# EAGLE design Fireplace Control (EAGLE 6.4)
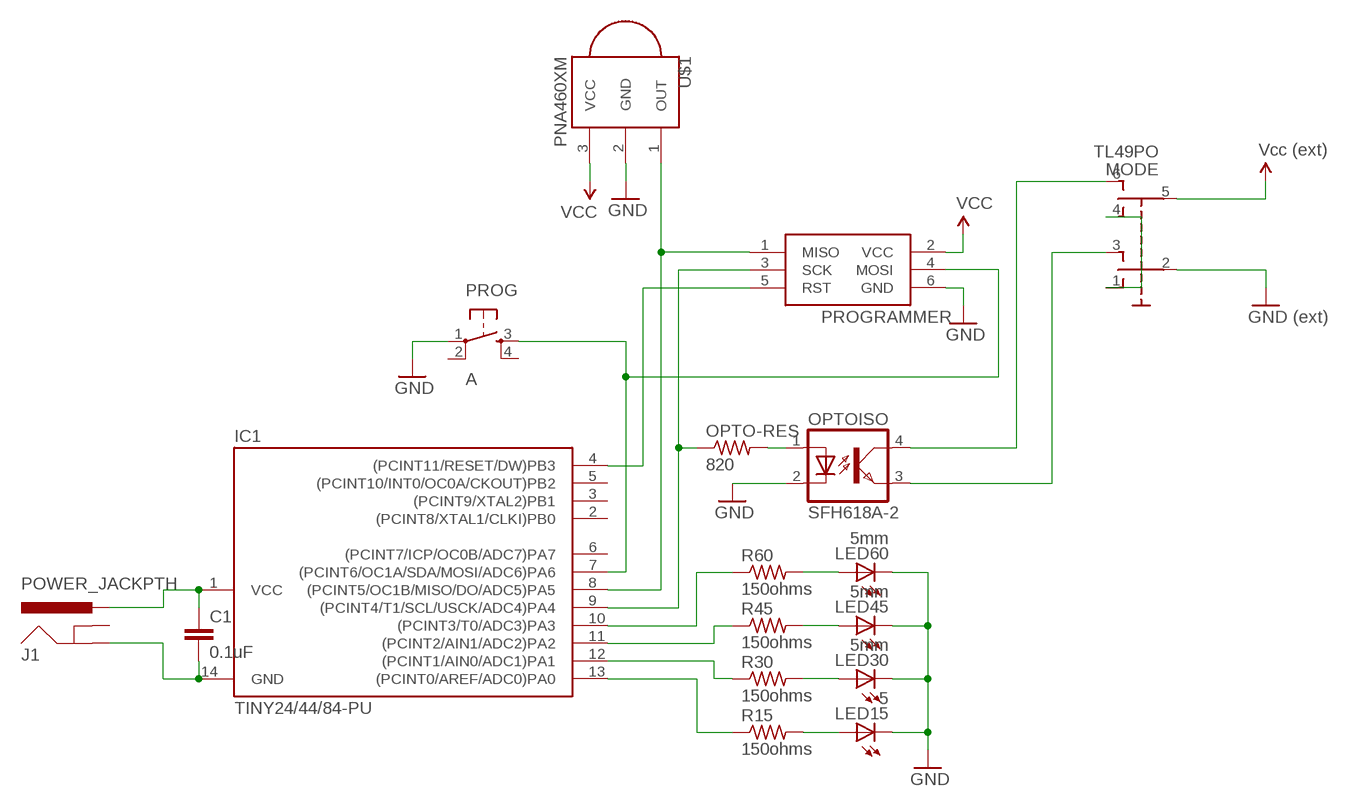
[diagram p0: schematic, sheet 1]

## Parts
C1  0.1uF  CAPKIT  [CAP-PTH-SMALL-KIT]
IC1  TINY24/44/84-PU  [DIL14]
J1  POWER_JACKPTH  [POWER_JACK_PTH]
LED15  5  LED3MM  [LED3MM]
LED30  5mm  LED3MM  [LED3MM]
LED45  5mm  LED3MM  [LED3MM]
LED60  5mm  LED3MM  [LED3MM]
MODE  TL49PO  [TL4XPO]
OPTO-RES  820  R-US_0411/15  [0411/15]
OPTOISO  SFH618A-2  [DIP4]
PROG  A  TAC_SWITCHPTH  [TACTILE-PTH]
PROGRAMMER  AVRISP-6  [AVRISP]
R15  150ohms  R-US_0411/15  [0411/15]
R30  150ohms  R-US_0411/15  [0411/15]
R45  150ohms  R-US_0411/15  [0411/15]
R60  150ohms  R-US_0411/15  [0411/15]
U$1  PNA460XM  [PNA460XM]

## Nets
GND: C1.2 IC1.14(GND) J1.GND LED15.K(C) LED30.K(C) LED45.K(C) LED60.K(C) MODE.2(P) OPTOISO.2(C) PROG.1 PROGRAMMER.6(GND) U$1.2(GND) ; supply symbol labelled GND (ext)
N$1: LED15.A R15.2
N$2: LED30.A R30.2
N$3: LED45.A R45.2
N$4: LED60.A R60.2
N$5: IC1.13((PCINT0/AREF/ADC0)PA0) R15.1
N$6: IC1.12((PCINT1/AIN0/ADC1)PA1) R30.1
N$7: IC1.11((PCINT2/AIN1/ADC2)PA2) R45.1
N$8: IC1.10((PCINT3/T0/ADC3)PA3) R60.1
N$9: OPTO-RES.2 OPTOISO.1(A)
N$10: IC1.7((PCINT6/OC1A/SDA/MOSI/ADC6)PA6) PROG.3 PROGRAMMER.4(MOSI)
N$11: IC1.9((PCINT4/T1/SCL/USCK/ADC4)PA4) OPTO-RES.1 PROGRAMMER.3(SCK)
N$12: IC1.8((PCINT5/OC1B/MISO/DO/ADC5)PA5) PROGRAMMER.1(MISO) U$1.1(OUT)
N$14: MODE.1(O) MODE.4(O1)
N$16: MODE.6(S1) OPTOISO.4(COL)
N$17: MODE.3(S) OPTOISO.3(EMIT)
N$18: IC1.4((PCINT11/RESET/DW)PB3) PROGRAMMER.5(RST)
VCC: C1.1 IC1.1(VCC) J1.PWR MODE.5(P1) PROGRAMMER.2(VCC) U$1.3(VCC) ; supply symbol labelled Vcc (ext)
Unconnected: IC1.2((PCINT8/XTAL1/CLKI)PB0) IC1.3((PCINT9/XTAL2)PB1) IC1.5((PCINT10/INT0/OC0A/CKOUT)PB2) IC1.6((PCINT7/ICP/OC0B/ADC7)PA7) J1.GNDBREAK PROG.2 PROG.4

## Library data of the parts
C1 = SparkFun-Capacitors:CAP: Capacitor Standard 0603 ceramic capacitor, and 0.1" leaded capacitor.
IC1 = avr-4:TINY24/44/84
J1 = SparkFun-Connectors:POWER_JACK: Power Jack This is the standard 5.5mm barrel jack for power. The PTH is the most common, proven, reliable, footprint. The Slot footprint only works if the mill layer is transmitted to the PCB fab house so be warned. Spark Fun Electronics SKU : PRT-00119 SMT: CONN-08106 Mating wall wart : TOL-00298 (and others)
LED15 LED30 LED45 LED60 = adafruit:LED: LED OSRAM: - CHIPLED LG R971, LG N971, LY N971, LG Q971, LY Q971, LO R971, LY R971 LH N974, LH R974 LS Q976, LO Q976, LY Q976 LO Q996 - Hyper CHIPLED LW Q18S LB Q993, LB Q99A, LB R99A - SideLED LS A670, LO A670, LY A670, LG A670, LP A670 LB A673, LV A673, LT A673, LW A673 LH A674 LY A675 LS A676, LA A676, LO A676, LY A676, LW A676 LS A679, LY A679, LG A679 - Hyper Micro SIDELED® LS Y876, LA Y876, LO Y876, LY Y876 LT Y87S - SmartLED LW L88C, LW L88S LB L89C, LB L89S, LG L890 LS L89K, LO L89K, LY L89K LS L896, LA L896, LO L896, LY L896 - TOPLED LS T670, LO T670, LY T670, LG T670, LP T670 LSG T670, LSP T670, LSY T670, LOP T670, LYG T670 LG T671, LOG T671, LSG T671 LB T673, LV T673, LT T673, LW T673 LH T674 LS T676, LA T676, LO T676, LY T676, LB T676, LH T676, LSB T676, LW T676 LB T67C, LV T67C, LT T67C, LS T67K, LO T67K, LY T67K, LW E67C LS E67B, LA E67B, LO E67B, LY E67B, LB E67C, LV E67C, LT E67C LW T67C LS T679, LY T679, LG T679 LS T770, LO T770, LY T770, LG T770, LP T770 LB T773, LV T773, LT T773, LW T773 LH T774 LS E675, LA E675, LY E675, LS T675 LS T776, LA T776, LO T776, LY T776, LB T776 LHGB T686 LT T68C, LB T68C - Hyper Mini TOPLED® LB M676 - Mini TOPLED Santana® LG M470 LS M47K, LO M47K, LY M47K Source: http://www.osram.convergy.de/
MODE = switch:TL49PO: TINY SWITCH ON OFF ON Source: http://www2.produktinfo.conrad.com/datenblaetter/700000-724999/705152-da-01-de-Subminiaturschalter_TL_36YO.pdf
OPTO-RES R15 R30 R45 R60 = adafruit:R-US_: RESISTOR, American symbol
OPTOISO = optocoupler:SFH618?*: Optocoupler, Phototransistor Output, Low Input Current Source: Data sheet <http://www.vishay.com/docs/83673/sfh618.pdf>; MF: VISHAY/TELEFUNKEN; MPN: SFH618A-2; OC_FARNELL: 6424855; OC_NEWARK: 21H7744
PROG = SparkFun-Electromechanical:TAC_SWITCH: Momentary Switch Button commonly used for reset or general input. Spark Fun Electronics SKU : COM-00097 SMT- SWCH-08247
PROGRAMMER = adafruit:AVRISP: AVR ISP HEADER Standard 6 pin header for AVR programming
U$1 = adafruit:PNA460XM: IR 38KHz receiver PNA4602 and related receivers http://www.ladyada.net/library/pcb/eaglelibrary.html

## Board
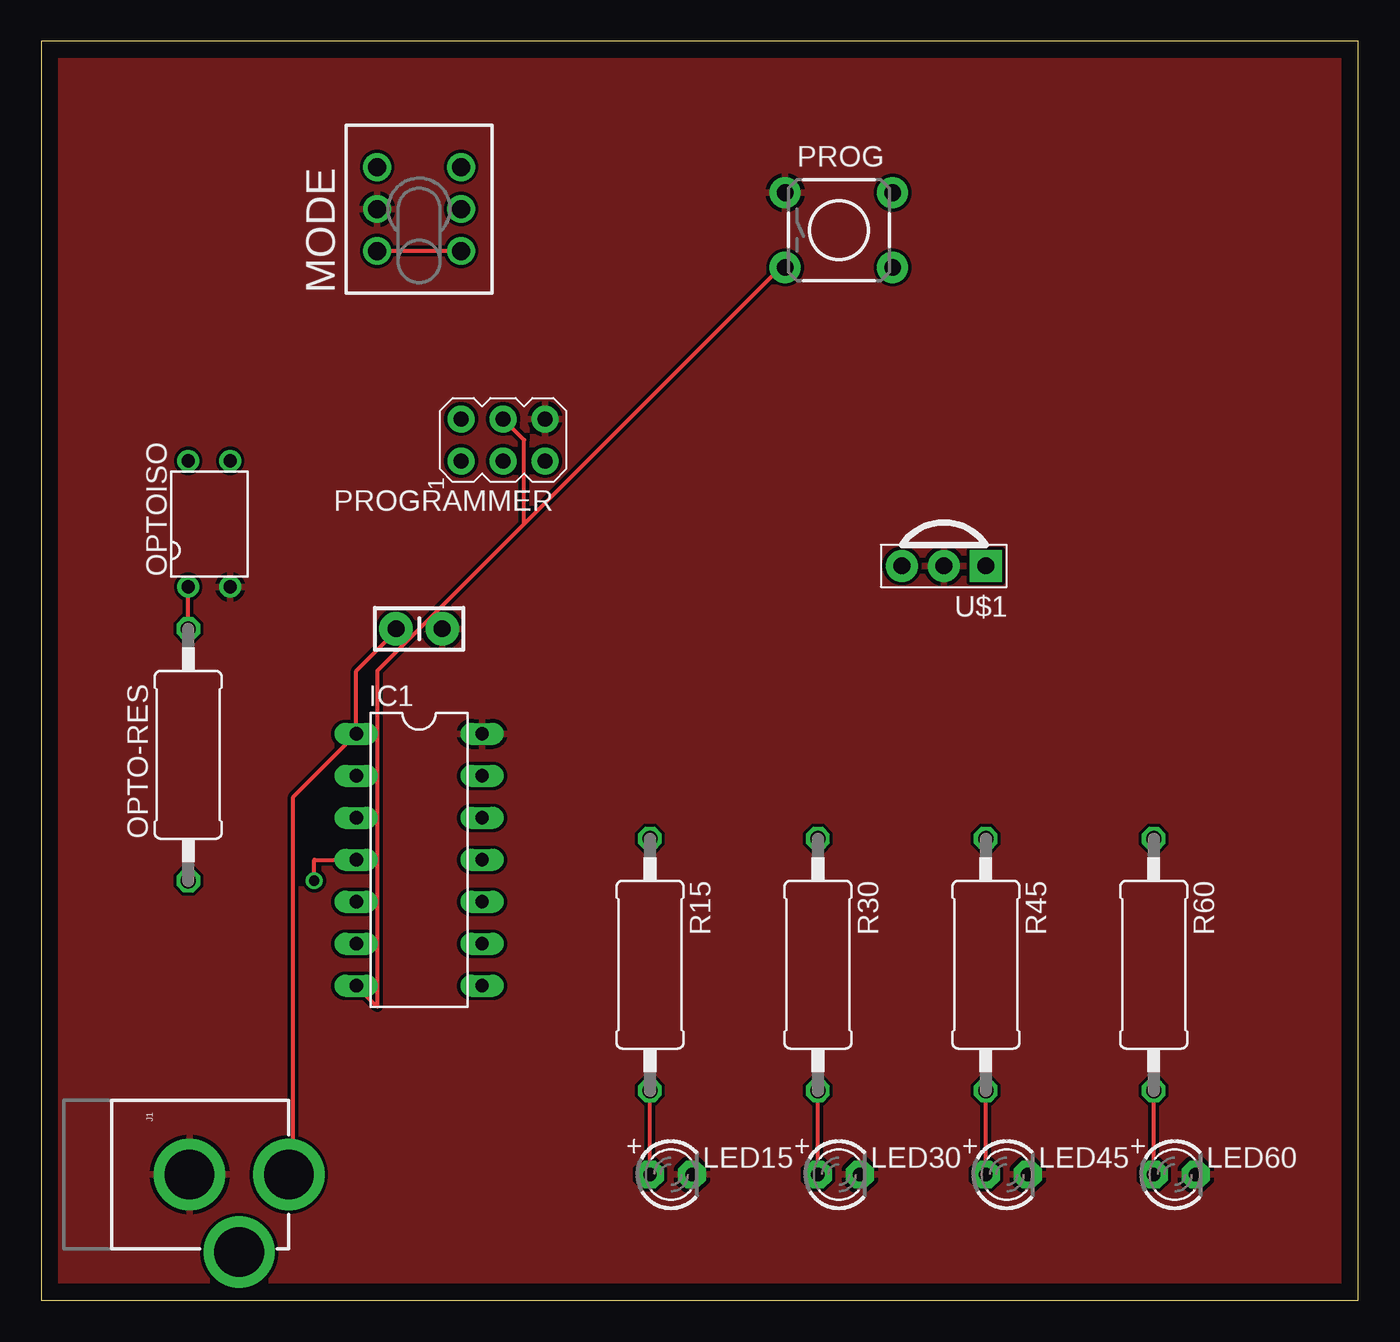
[diagram p1: board, top side]
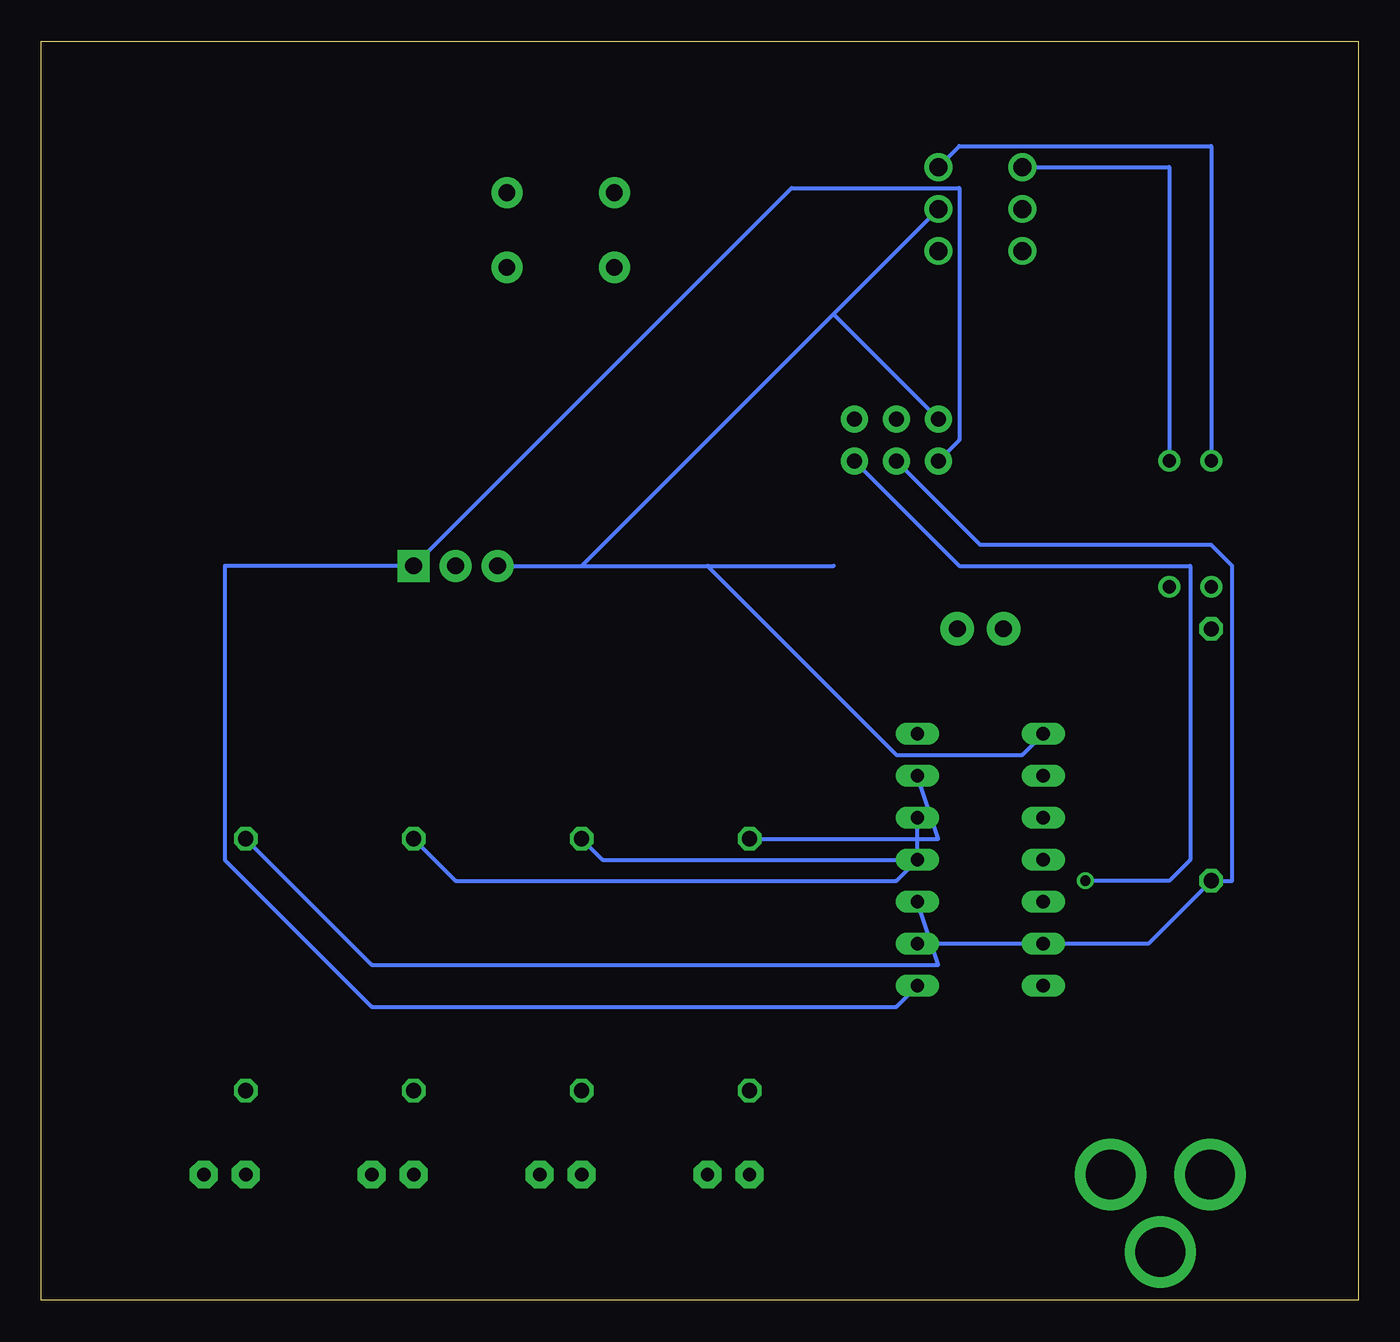
[diagram p2: board, bottom side, seen from below]

Size 79.68 x 76.19 mm. Coordinates in mm from the lower left corner, seen from the top.
Outline: 0,0 79.68,0 79.68,76.19 0,76.19 0,0
Copper layers (1*16): Top 0.035mm / dielectric 1.5mm / Bottom 0.035mm
Design rules "default": minimum track width 10mil, minimum drill 24mil, track to track 8mil, track to pad 8mil, pad to pad 8mil, via to via 8mil, smd to smd 8mil, copper to edge 40mil, drill to drill 8mil, minimum pad ring 10mil, minimum via ring 8mil, stop-mask expansion 4mil, vias tented up to drill 0mil, thermal gap 10mil

### Footprints (pad centres in the part's own frame; a part is rotated, then mirrored left to right if it is on the bottom)
CAP-PTH-SMALL-KIT = drill 1.016 pad 2.032: 1 -1.397,0; 2 1.397,0
DIL14 = drill 0.813 long: 1 -7.62,-3.81; 2 -5.08,-3.81; 3 -2.54,-3.81; 4 0,-3.81; 5 2.54,-3.81; 6 5.08,-3.81; 7 7.62,-3.81; 8 7.62,3.81; 9 5.08,3.81; 10 2.54,3.81; 11 0,3.81; 12 -2.54,3.81; 13 -5.08,3.81; 14 -7.62,3.81
POWER_JACK_PTH = drill 2.997 pad 4.318: GND 0,7.7; GNDBREAK 4.7,10.7; PWR 0,13.7
LED3MM = drill 0.813 pad 1.676 octagon: A -1.27,0; K 1.27,0
TL4XPO = drill 1.1 pad 1.676: 1 -2.54,2.54; 2 0,2.54; 3 2.54,2.54; 4 -2.54,-2.54; 5 0,-2.54; 6 2.54,-2.54
0411/15 = drill 0.914 octagon: 1 -7.62,0; 2 7.62,0
DIP4 = drill 0.8: 1 -1.27,-3.81; 2 1.27,-3.81; 3 1.27,3.81; 4 -1.27,3.81
TACTILE-PTH = drill 1.016 pad 1.88: 1 -3.251,2.261; 2 3.251,2.261; 3 -3.251,-2.261; 4 3.251,-2.261
AVRISP = drill 0.9 pad 1.626: 1 -1.27,2.54; 2 1.27,2.54; 3 -1.27,0; 4 1.27,0; 5 -1.27,-2.54; 6 1.27,-2.54
PNA460XM = drill 1.016 pad 1.93 square: 1 -2.54,0 | drill 1.016 pad 1.93: 2 0,0; 3 2.54,0

### Placement (x,y rotation side)
C1  22.86,40.64 0 top
IC1  22.86,26.67 270 top
J1  1.27,7.62 270 top
LED15  38.1,7.62 0 top
LED30  48.26,7.62 0 top
LED45  58.42,7.62 0 top
LED60  68.58,7.62 0 top
MODE  22.86,66.04 90 top
OPTO-RES  8.89,33.02 90 top
OPTOISO  10.16,46.99 0 top
PROG  48.26,64.77 0 top
PROGRAMMER  27.94,52.07 90 top
R15  36.83,20.32 270 top
R30  46.99,20.32 270 top
R45  57.15,20.32 270 top
R60  67.31,20.32 270 top
U$1  54.61,44.45 180 top

### Tracks (layer width: path | path; a pad name or v marks a point on that pad's centre or on a via)
GND
  pour Top: -2.54,76.2 81.28,76.2 81.28,-1.27 -2.54,-1.27
N$1
  Top 0.254: LED15.A R15.2
N$2
  Top 0.254: LED30.A R30.2
N$3
  Top 0.254: LED45.A R45.2
N$4
  Top 0.254: LED60.A R60.2
N$5
  Bottom 0.254: IC1.13 25.4,27.94 R15.1
N$6
  Bottom 0.254: IC1.12 26.67,26.67 45.72,26.67 R30.1
N$7
  Bottom 0.254: IC1.11 27.94,25.4 54.61,25.4 R45.1
N$8
  Bottom 0.254: IC1.10 25.4,20.32 59.69,20.32 R60.1
N$9
  Top 0.254: OPTO-RES.2 OPTOISO.1
N$10
  Top 0.254: IC1.7 20.32,17.78 20.32,38.1 29.21,46.99 | 29.21,46.99 44.45,62.23 PROG.3 | PROGRAMMER.4 29.21,52.07 29.21,46.99
N$11
  Bottom 0.254: IC1.9 12.7,21.59 OPTO-RES.1 7.62,25.4 7.62,44.45 8.89,45.72 22.86,45.72 PROGRAMMER.3
N$12
  Bottom 0.254: IC1.8 27.94,17.78 59.69,17.78 68.58,26.67 68.58,44.45 U$1.1 34.29,67.31 24.13,67.31 24.13,52.07 PROGRAMMER.1
N$14
  Top 0.254: MODE.4 MODE.1
N$16
  Bottom 0.254: OPTOISO.4 8.89,69.85 24.13,69.85 MODE.6
N$17
  Bottom 0.254: OPTOISO.3 11.43,68.58 MODE.3
N$18  (via drill 0.61)
  Top 0.254: IC1.4 16.51,26.67 v16.51,25.4
  Bottom 0.254: v16.51,25.4 11.43,25.4 10.16,26.67 10.16,44.45 24.13,44.45 PROGRAMMER.5
VCC
  Top 0.254: J1.PWR 15.24,7.62 15.24,30.48 IC1.1 19.05,38.1 21.59,40.64 C1.1
  Bottom 0.254: U$1.3 46.99,44.45 | 46.99,44.45 39.37,44.45 | 39.37,44.45 31.75,44.45 | 46.99,44.45 31.75,59.69 | 31.75,59.69 MODE.5 | IC1.1 20.32,33.02 27.94,33.02 39.37,44.45 | 31.75,59.69 PROGRAMMER.2